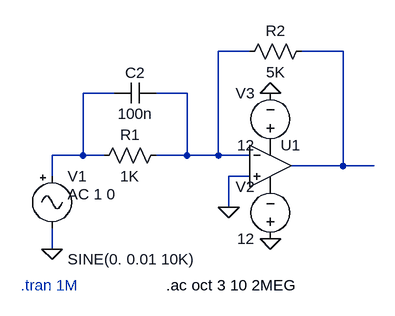
[diagram p0: schematic Lab3.asc]
Lab3.asc, the LTspice schematic file:
Version 4
SHEET 1 1456 680
WIRE 192 0 144 0
WIRE 336 0 272 0
WIRE -16 64 -64 64
WIRE 96 64 48 64
WIRE -64 160 -64 64
WIRE -64 160 -112 160
WIRE -32 160 -64 160
WIRE 96 160 96 64
WIRE 96 160 48 160
WIRE 144 160 144 0
WIRE 144 160 96 160
WIRE 192 160 144 160
WIRE 336 176 336 0
WIRE 336 176 256 176
WIRE 384 176 336 176
WIRE -112 192 -112 160
WIRE 192 192 160 192
WIRE 160 240 160 192
WIRE -112 304 -112 272
FLAG 160 240 0
FLAG -112 304 0
FLAG 224 288 0
FLAG 224 64 0
SYMBOL OpAmps\\UniversalOpAmp2 224 176 R0
SYMATTR InstName U1
SYMBOL res 64 144 R90
WINDOW 0 0 56 VBottom 2
WINDOW 3 32 56 VTop 2
SYMATTR InstName R1
SYMATTR Value 1K
SYMBOL res 288 -16 R90
WINDOW 0 0 56 VBottom 2
WINDOW 3 32 56 VTop 2
SYMATTR InstName R2
SYMATTR Value 5K
SYMBOL Misc\\signal -112 176 R0
WINDOW 123 24 44 Left 2
WINDOW 39 0 0 Left 0
WINDOW 3 24 144 Left 2
SYMATTR Value2 AC 1 0
SYMATTR Value SINE(0. 0.01 10K)
SYMATTR InstName V1
SYMBOL voltage 224 304 R180
WINDOW 0 24 96 Left 2
WINDOW 3 24 16 Left 2
WINDOW 123 0 0 Left 0
WINDOW 39 0 0 Left 0
SYMATTR InstName V2
SYMATTR Value 12
SYMBOL voltage 224 160 R180
WINDOW 0 24 96 Left 2
WINDOW 3 24 16 Left 2
WINDOW 123 0 0 Left 0
WINDOW 39 0 0 Left 0
SYMATTR InstName V3
SYMATTR Value 12
SYMBOL cap 48 48 R90
WINDOW 0 0 32 VBottom 2
WINDOW 3 32 32 VTop 2
SYMATTR InstName C2
SYMATTR Value 100n
TEXT -160 360 Left 2 ;.tran 1M
TEXT 64 360 Left 2 !.ac oct 3 10 2MEG

The netlist it stands for:
* Lab3.asc
XU1 0 N001 P001 P002 N002 level2 Avol=1Meg GBW=10Meg Slew=10Meg Ilimit=25m Rail=0 Vos=0 En=0 Enk=0 In=0 Ink=0 Rin=500Meg  ; pins In+ In- V+ V- OUT
R1 N001 N003 1K
R2 N002 N001 5K
V1 N003 0 SINE(0. 0.01 10K) AC 1 0
V2 0 P002 12
V3 P001 0 12
C2 N001 N003 100n
* .tran 1M
.ac oct 3 10 2MEG
.lib UniversalOpAmp2.lib
.backanno
.end